# EAGLE design 1001-B Clone SMD (EAGLE 6.3)
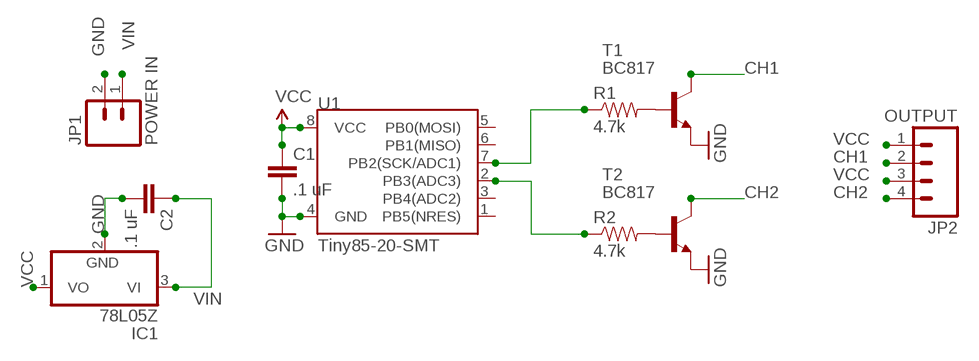
[diagram p0: schematic, sheet 1]

## Parts
C1  .1 uF  CAP1206  [1206]
C2  .1 uF  CAP1206  [1206]
IC1  78L05Z  [TO92]
JP1  POWER IN  M023.5MM  [SCREWTERMINAL-3.5MM-2]
JP2  OUTPUT  M04SCREW  [SCREWTERMINAL-3.5MM-4]
R1  4.7k  RESISTOR1206  [1206]
R2  4.7k  RESISTOR1206  [1206]
T1  BC817  BC817-16-NPN-SOT23-BEC  [SOT23-BEC]
T2  BC817  BC817-16-NPN-SOT23-BEC  [SOT23-BEC]
U1  Tiny85-20-SMT  ATTINY45TINY85-20-SMT  [SO08-EIAJ]

## Nets
CH1: JP2.2 T1.C
CH2: JP2.4 T2.C
GND: C1.2 C2.2 IC1.2(GND) JP1.2 T1.E T2.E U1.4(GND)
N$3: R1.2 T1.B
N$4: R2.2 T2.B
N$5: R1.1 U1.7(PB2(SCK/ADC1))
N$6: R2.1 U1.2(PB3(ADC3))
VCC: C1.1 IC1.1(VO) JP2.1 JP2.3 U1.8(VCC)
VIN: C2.1 IC1.3(VI) JP1.1
Unconnected: U1.1(PB5(NRES)) U1.3(PB4(ADC2)) U1.5(PB0(MOSI)) U1.6(PB1(MISO))

## Library data of the parts
C1 C2 = SparkFun-Capacitors:CAP: Capacitor Standard 0603 ceramic capacitor, and 0.1" leaded capacitor.
IC1 = linear:78*: Positive VOLTAGE REGULATOR Source: http://cache.national.com/ds/LM/LM78L05.pdf http://www.fairchildsemi.com/ds/LM/LM7805.pdf
JP1 = SparkFun-Connectors:M02: Header 2 Standard 2-pin 0.1" header. Use with straight break away headers (SKU : PRT-00116), right angle break away headers (PRT-00553), swiss pins (PRT-00743), machine pins (PRT-00117), and female headers (PRT-00115). Molex polarized connector foot print use with SKU : PRT-08233 with associated crimp pins and housings.
JP2 = SparkFun-Connectors:M04: Header 4 Standard 4-pin 0.1" header. Use with straight break away headers (SKU : PRT-00116), right angle break away headers (PRT-00553), swiss pins (PRT-00743), machine pins (PRT-00117), and female headers (PRT-00115). Molex polarized connector foot print use with SKU : PRT-08231 with associated crimp pins and housings. 1MM SMD Version SKU: PRT-10208
R1 R2 = SparkFun-Resistors:RESISTOR: Resistor Basic schematic elements and footprints for 0603, 1206, and PTH resistors.
T1 T2 = transistor:*-NPN-: NPN Transistror BF959 corrected 2008.03.06
U1 = SparkFun-DigitalIC:ATTINY45: Atmel 8-pin 2/4/8kB flash uC; PROD_ID: IC-09092

## Board
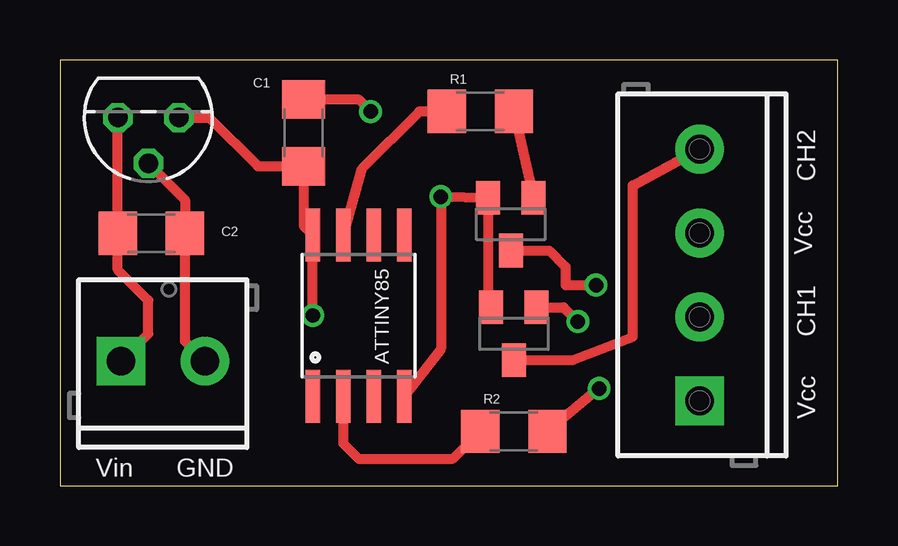
[diagram p1: board, top side]
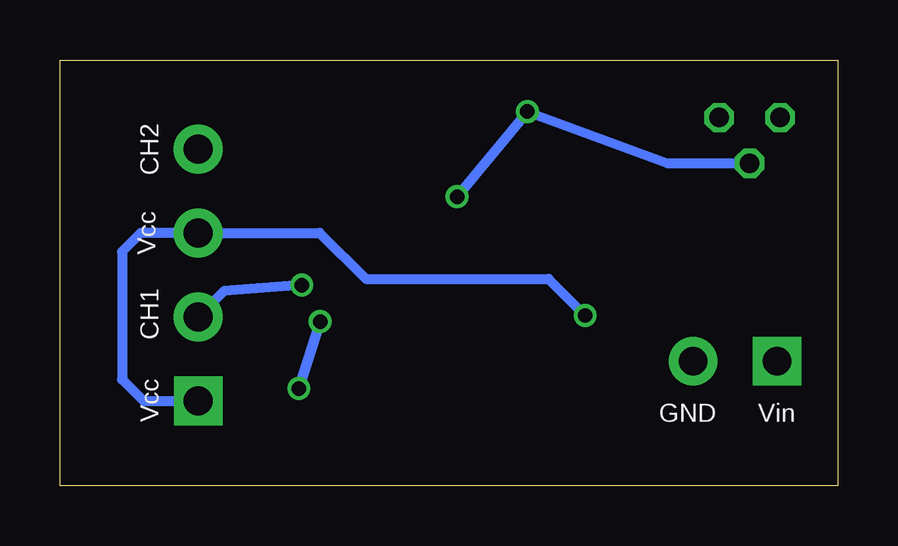
[diagram p2: board, bottom side, seen from below]

Size 32.44 x 17.77 mm. Coordinates in mm from the lower left corner, seen from the top.
Outline: 0,0 32.44,0 32.44,17.77 0,17.77 0,0
Copper layers (1*16): Top 0.0356mm / dielectric 1.5011mm / Bottom 0.0356mm
Design rules "LaenPCBOrder": minimum track width 6mil, minimum drill 13mil, track to track 6mil, track to pad 6mil, pad to pad 6mil, via to via 6mil, smd to smd 6mil, copper to edge 15mil, drill to drill 6mil, minimum pad ring 7mil, minimum via ring 7mil, stop-mask expansion 4mil, vias tented up to drill 0mil, thermal gap 10mil

### Footprints (pad centres in the part's own frame; a part is rotated, then mirrored left to right if it is on the bottom)
1206 = smd 1.6 x 1.8: 1 -1.4,0; 2 1.4,0
TO92 = drill 0.813 octagon: 1 -1.27,0; 2 0,1.905; 3 1.27,0
SCREWTERMINAL-3.5MM-2 = drill 1.2 pad 2.032 square: 1 0,0 | drill 1.2 pad 2.032: 2 3.5,0
SCREWTERMINAL-3.5MM-4 = drill 1.2 pad 2.032 square: 1 0,0 | drill 1.2 pad 2.032: 2 3.5,0; 3 7,0; 4 10.5,0
SOT23-BEC = smd 1 x 1.4: B -0.95,-1.1; C 0,1.1; E 0.95,-1.1
SO08-EIAJ = smd 0.61 x 2.21: 1 -1.905,-3.378; 2 -0.635,-3.378; 3 0.635,-3.378; 4 1.905,-3.378; 5 1.905,3.353; 6 0.635,3.353; 7 -0.635,3.353; 8 -1.905,3.353

### Placement (x,y rotation side)
C1  10.16,14.73 90 top
C2  3.81,10.54 0 top
IC1  3.68,15.37 180 top
JP1  2.54,5.21 0 top
JP2  26.67,3.56 90 top
R1  17.53,15.62 0 top
R2  18.92,2.29 0 top
T1  18.8,10.92 180 top
T2  18.92,6.35 180 top
U1  12.45,7.11 0 top

### Tracks (layer width: path | path; a pad name or v marks a point on that pad's centre or on a via)
CH1  (via drill 0.6)
  Top 0.406: T1.C 20.4,9.82 21.08,9.14 21.08,8.38 v22.35,8.38
  Bottom 0.406: v22.35,8.38 25.6,8.13 JP2.2
CH2
  Top 0.406: T2.C 21.38,5.25 23.88,6.22 23.88,12.53 JP2.4
GND  (via drill 0.6)
  Top 0.406: IC1.2 5.21,11.94 C2.2 5.21,6.04 JP1.2 | 17.89,7.37 T2.E 17.85,7.58 T1.E v15.88,12.06 15.88,5.71 U1.4 | C1.2 12.44,16.13 v12.95,15.62
  Bottom 0.406: IC1.2 7.11,13.46 v12.95,15.62 v15.88,12.06
N$3
  Top 0.406: R1.2 T1.B
N$4  (via drill 0.6)
  Top 0.406: T2.B 21,7.45 v21.59,6.86 | v22.48,4.06 R2.2
  Bottom 0.406: v21.59,6.86 v22.48,4.06
N$5
  Top 0.406: R1.1 14.99,15.62 12.57,13.21 U1.7
N$6
  Top 0.406: U1.2 11.81,1.78 12.45,1.14 16.38,1.14 R2.1
VCC  (via drill 0.6)
  Top 0.406: IC1.1 6.22,15.37 8.26,13.34 C1.1 10.16,10.85 U1.8 v10.54,7.11
  Bottom 0.406: JP2.1 28.96,3.56 29.84,4.45 29.84,9.78 29.07,10.56 JP2.3 21.61,10.56 19.68,8.64 12.06,8.64 v10.54,7.11
VIN
  Top 0.406: JP1.1 3.68,6.35 3.68,7.75 2.41,9.02 C2.1 IC1.3

### Text on the board
tPlace: CH2 | Vcc | CH1 | ATTINY85 | Vcc | Vin | GND
bPlace: CH2 | Vcc | CH1 | Vin | GND | Vcc